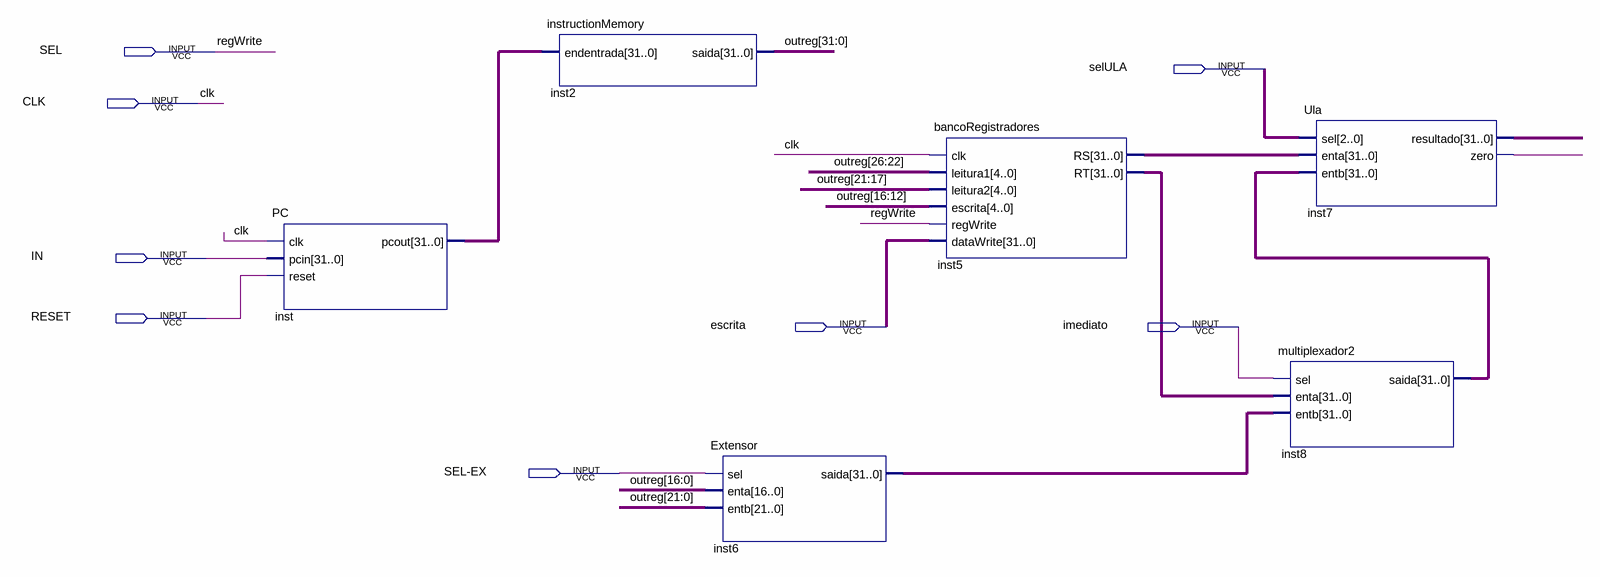
[diagram p0: schematic sheet]
// Quartus schematic esquematico1.bdf as structural Verilog: 6 symbols, 8 pins
module esquematico1 (
  input  SEL,
  input  selULA,
  input  CLK,
  input  IN,
  input  RESET,
  input  escrita,
  input  imediato,
  input  \SEL-EX 
);

  wire inst7_zero;
  wire [2:0] undriven;
  wire [31:0] inst5_rs, inst5_rt, inst6_saida, inst7_resultado, inst8_saida, inst_pcout, outreg, undriven_2;

  PC inst (.clk(CLK), .pcin({32{IN}}), .reset(RESET), .pcout(inst_pcout));
  instructionMemory inst2 (.endentrada(inst_pcout), .saida(outreg));
  Extensor inst6 (.sel(\SEL-EX ), .enta(outreg[16:0]), .entb(outreg[21:0]), .saida(inst6_saida));
  bancoRegistradores inst5 (
    .clk(CLK), .leitura1(outreg[26:22]), .leitura2(outreg[21:17]), .escrita(outreg[16:12]), .regWrite(SEL),
    .dataWrite(undriven_2), .RS(inst5_rs), .RT(inst5_rt));
  Ula inst7 (.sel(undriven), .enta(inst5_rs), .entb(inst8_saida), .resultado(inst7_resultado), .zero(inst7_zero));
  multiplexador2 inst8 (.sel(imediato), .enta(inst5_rt), .entb(inst6_saida), .saida(inst8_saida));

  // Other names for the same wires on the sheet: regWrite = SEL
endmodule
